# Altium schematic sheet PowerCommConnector.SchDoc
size A; DocumentNumber: 14; SheetNumber: 14
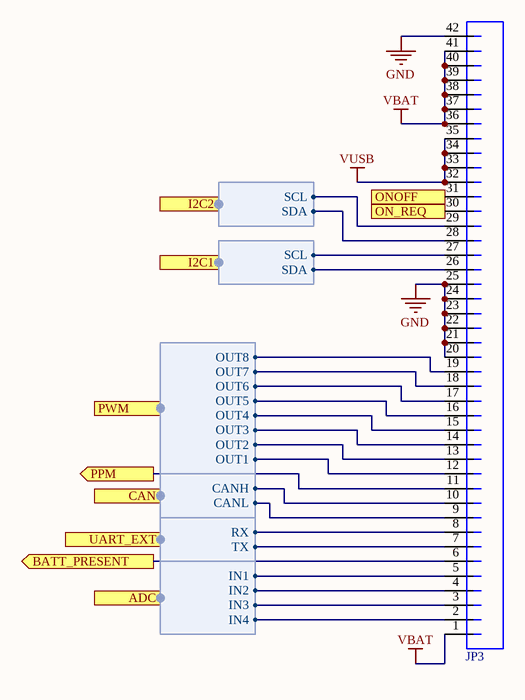
[diagram p0: PowerCommConnector.SchDoc]

## Parts
JP3  HIROSE_BM23PF_40_RECEPTACLE  [HIROSE-BM23PF-40-0.35MM-RECEPTACLE]  (value not drawn)

## Ports
ADC (harness ADC), BATT_PRESENT (out), CAN (harness CAN), I2C1 (harness I2C), I2C2 (harness I2C), ON_REQ (in), ONOFF (out), PPM (out), PWM (harness PWM), UART_EXT (harness UART)

## Harnesses
I2C: SCL, SDA
PWM: OUT8, OUT7, OUT1, OUT3, OUT2, OUT4, OUT6, OUT5
ADC: IN3, IN2, IN1, IN4
CAN: CANL, CANH
UART: TX, RX

## Nets
GND: JP3.20 JP3.21 JP3.22 JP3.23 JP3.24 JP3.25 JP3.42
VBAT: JP3.1 JP3.36 JP3.37 JP3.38 JP3.39 JP3.40 JP3.41
VUSB: JP3.32 JP3.33 JP3.34 JP3.35
BATT_PRESENT: JP3.6 ; port BATT_PRESENT
ON_REQ: JP3.30 ; port ON_REQ
ONOFF: JP3.31 ; port ONOFF
PPM: JP3.11 ; port PPM
NetJP3_2: JP3.2 ; port ADC.IN4
NetJP3_3: JP3.3 ; port ADC.IN3
NetJP3_4: JP3.4 ; port ADC.IN2
NetJP3_5: JP3.5 ; port ADC.IN1
NetJP3_7: JP3.7 ; port UART_EXT.TX
NetJP3_8: JP3.8 ; port UART_EXT.RX
NetJP3_9: JP3.9 ; port CAN.CANL
NetJP3_10: JP3.10 ; port CAN.CANH
NetJP3_12: JP3.12 ; port PWM.OUT1
NetJP3_13: JP3.13 ; port PWM.OUT2
NetJP3_14: JP3.14 ; port PWM.OUT3
NetJP3_15: JP3.15 ; port PWM.OUT4
NetJP3_16: JP3.16 ; port PWM.OUT5
NetJP3_17: JP3.17 ; port PWM.OUT6
NetJP3_18: JP3.18 ; port PWM.OUT7
NetJP3_19: JP3.19 ; port PWM.OUT8
NetJP3_26: JP3.26 ; port I2C1.SDA
NetJP3_27: JP3.27 ; port I2C1.SCL
NetJP3_28: JP3.28 ; port I2C2.SDA
NetJP3_29: JP3.29 ; port I2C2.SCL

## Library data of the parts
JP3 = HIROSE_BM23PF_40_RECEPTACLE: CONN RCPT 0.35MM SMD 40POS; Manufacturer: Hirose; PartNumber: BM23PF0.8-40DS-0.35V(51); PackageReference: BM23PF-0.35; Mounting Technology: Surface Mount